# EAGLE schematic pipistrello_v2 (EAGLE 6.3)

## Sheet 1 of 5
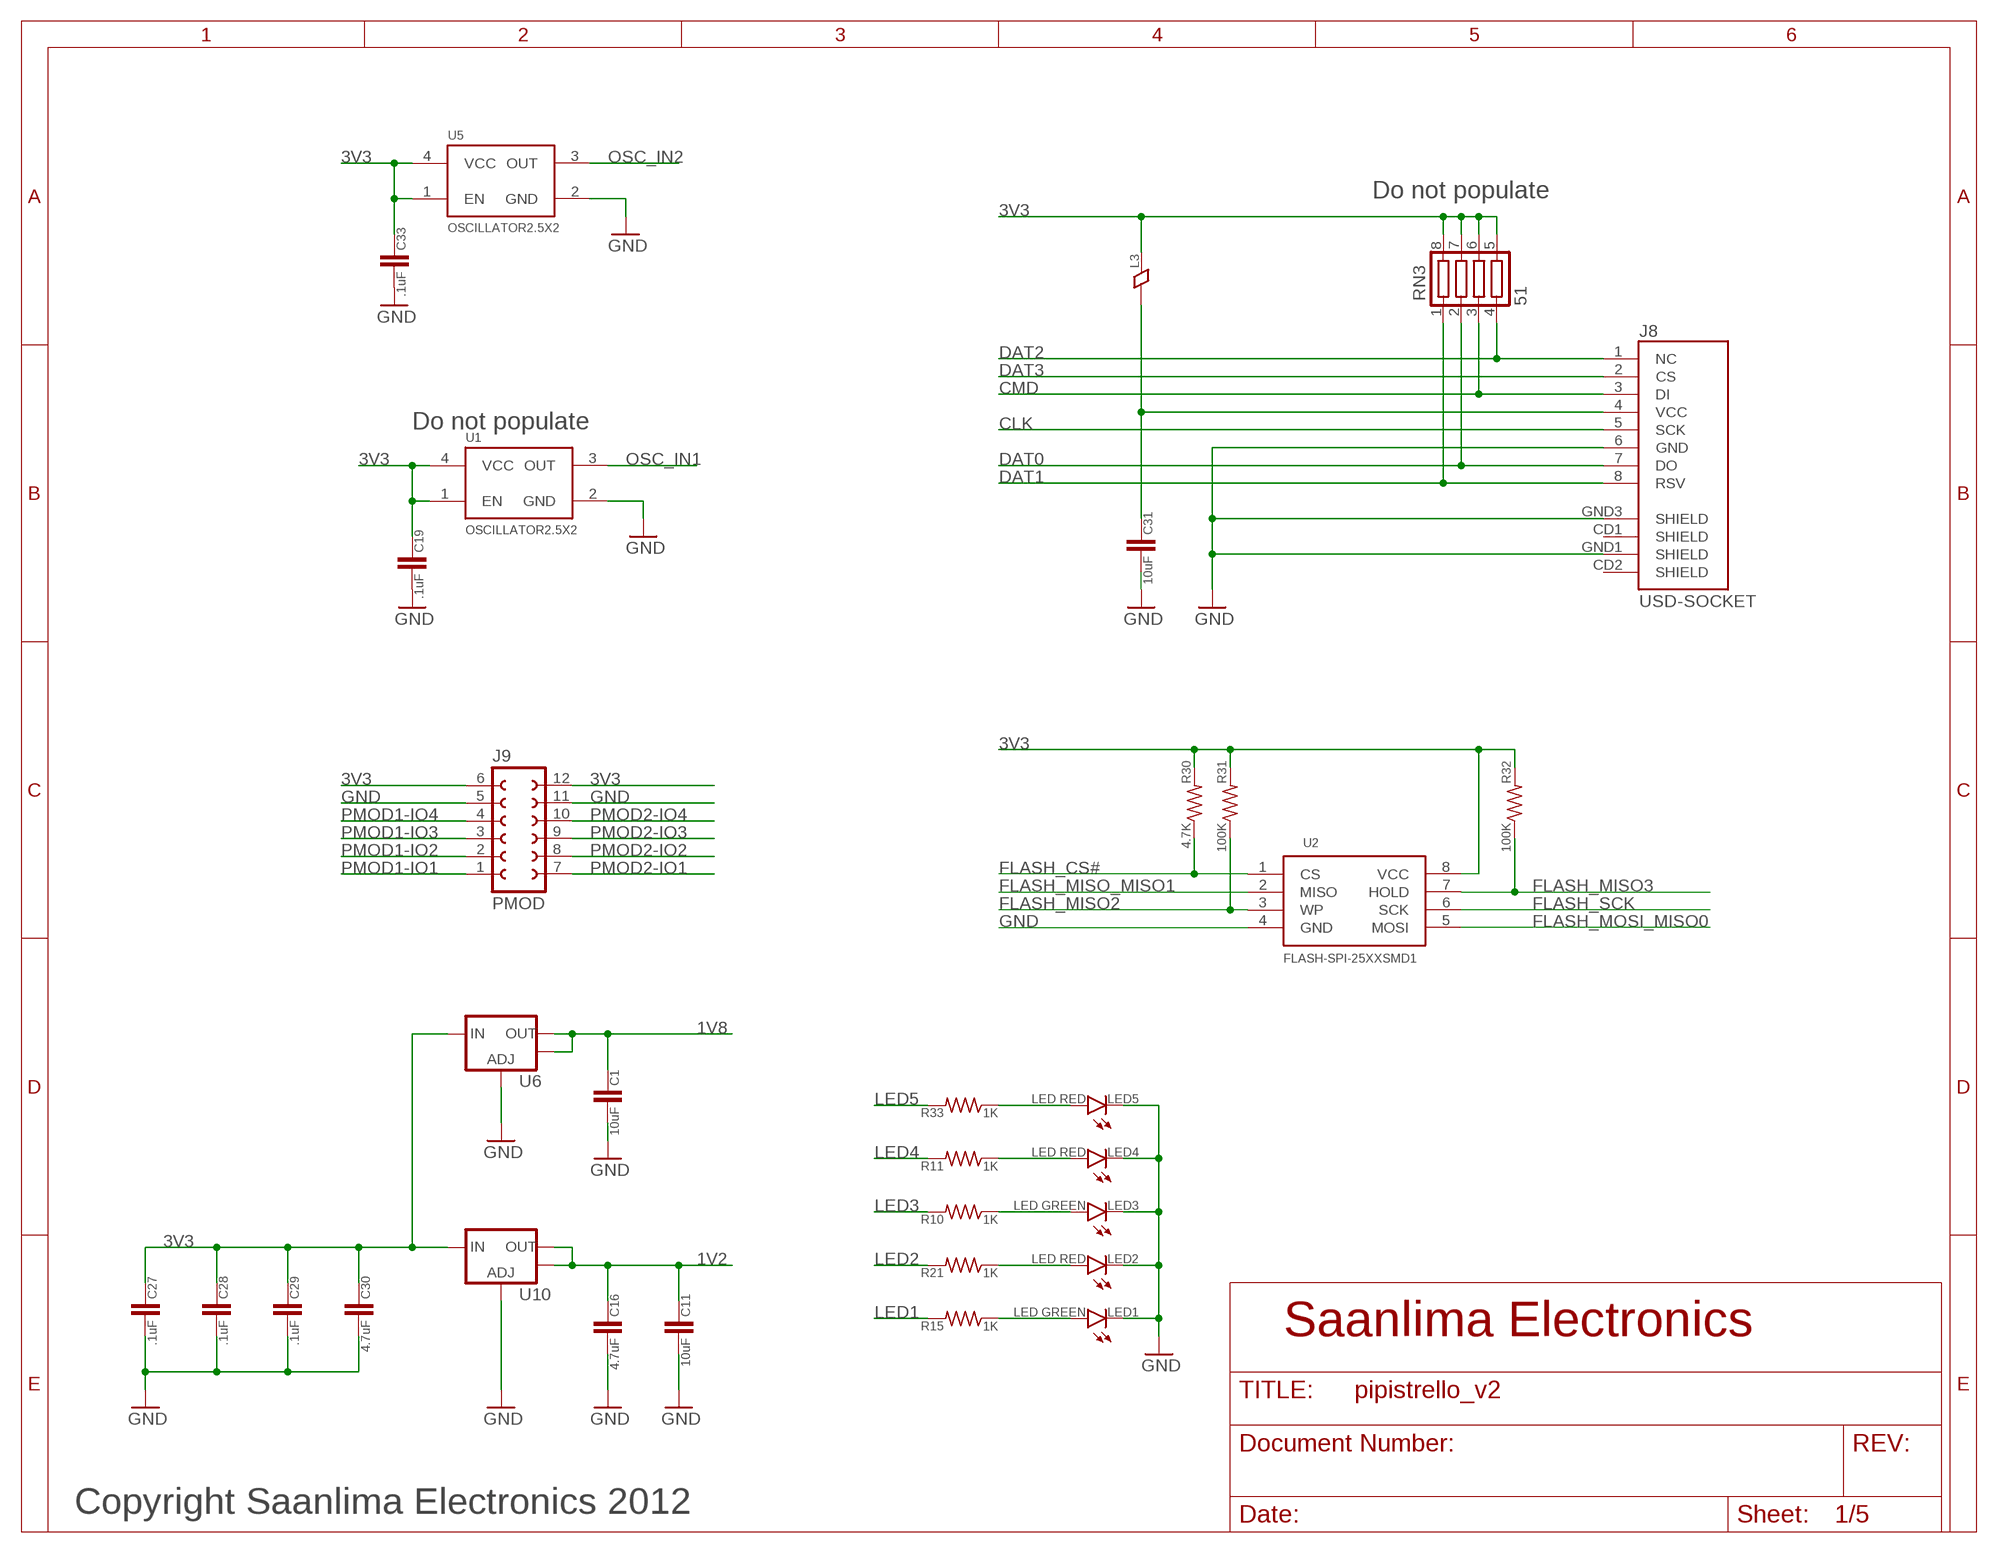
[diagram p0: schematic, sheet 1]

### Parts
C1  10uF  C0805  [0805]
C11  10uF  C0805  [0805]
C16  4.7uF  C0402  [0402]
C19  .1uF  C0402  [0402]
C27  .1uF  C0402  [0402]
C28  .1uF  C0402  [0402]
C29  .1uF  C0402  [0402]
C30  4.7uF  C0402  [0402]
C31  10uF  C0603  [0603]
C33  .1uF  C0402  [0402]
J8  USD-SOCKET  USD-SOCKETNEW  [MICRO-SD-SOCKET-PP]
J9  PMOD  [PMOD]
L3  FERRITE0402  [0402]
LED1  LED GREEN  LED0805  [0805_POL]
LED2  LED RED  LED0805  [0805_POL]
LED3  LED GREEN  LED0805  [0805_POL]
LED4  LED RED  LED0805  [0805_POL]
LED5  LED RED  LED0805  [0805_POL]
R10  1K  R0402  [0402]
R11  1K  R0402  [0402]
R15  1K  R0402  [0402]
R21  1K  R0402  [0402]
R30  4.7K  R0402  [0402]
R31  100K  R0402  [0402]
R32  100K  R0402  [0402]
R33  1K  R0402  [0402]
RN3  51  CTS742C083  [CTS742C083]
U1  OSCILLATOR2.5X2  [CRYSTAL-OSC-SMD-2.5X2]
U2  FLASH-SPI-25XXSMD1  [SO08-EIAJ]
U5  OSCILLATOR2.5X2  [CRYSTAL-OSC-SMD-2.5X2]
U6  V_REG_LM1117SOT223  [SOT223]
U10  V_REG_LM1117SOT223  [SOT223]

### Nets
1V2: C11.1 C16.1 U10.2(OUT) U10.4(OUT) ; also sheet 3
1V8: C1.1 U6.2(OUT) U6.4(OUT) ; also sheet 3
3V3: C19.1 C27.1 C28.1 C29.1 C30.1 C33.1 J9.6 J9.12 L3.2 R30.2 R31.2 R32.2 RN3.5 RN3.6 RN3.7 RN3.8 U1.1(EN) U1.4(VCC) U2.8(VCC) U5.1(EN) U5.4(VCC) U6.3(IN) U10.3(IN) ; also sheet 2,3,4,5
CLK: J8.5(SCK) ; also sheet 3
CMD: J8.3(DI) RN3.3 ; also sheet 3
DAT0: J8.7(DO) RN3.2 ; also sheet 3
DAT1: J8.8(RSV) RN3.1 ; also sheet 3
DAT2: J8.1(NC) RN3.4 ; also sheet 3
DAT3: J8.2(CS) ; also sheet 3
FLASH_CS#: R30.1 U2.1(CS) ; also sheet 3
FLASH_MISO2: R31.1 U2.3(WP) ; also sheet 3
FLASH_MISO3: R32.1 U2.7(HOLD) ; also sheet 3
FLASH_MISO_MISO1: U2.2(MISO) ; also sheet 3
FLASH_MOSI_MISO0: U2.5(MOSI) ; also sheet 3
FLASH_SCK: U2.6(SCK) ; also sheet 3
GND: C1.2 C11.2 C16.2 C19.2 C27.2 C28.2 C29.2 C30.2 C31.2 C33.2 J8.6(GND) J8.GND1(SHIELD) J8.GND3(SHIELD) J9.5 J9.11 LED1.-(C) LED2.-(C) LED3.-(C) LED4.-(C) LED5.-(C) U1.2(GND) U2.4(GND) U5.2(GND) U6.1(ADJ) U10.1(ADJ) ; also sheet 2,3,4,5
LED1: R15.2 ; also sheet 3
LED2: R21.2 ; also sheet 3
LED3: R10.2 ; also sheet 3
LED4: R11.2 ; also sheet 3
LED5: R33.2 ; also sheet 3
N$3: LED2.+(A) R21.1
N$6: LED3.+(A) R10.1
N$7: C31.1 J8.4(VCC) L3.1
N$8: LED1.+(A) R15.1
N$12: LED4.+(A) R11.1
N$24: LED5.+(A) R33.1
OSC_IN1: U1.3(OUT) ; also sheet 3
OSC_IN2: U5.3(OUT) ; also sheet 3
PMOD1-IO1: J9.1 ; also sheet 3
PMOD1-IO2: J9.2 ; also sheet 3
PMOD1-IO3: J9.3 ; also sheet 3
PMOD1-IO4: J9.4 ; also sheet 3
PMOD2-IO1: J9.7 ; also sheet 3
PMOD2-IO2: J9.8 ; also sheet 3
PMOD2-IO3: J9.9 ; also sheet 3
PMOD2-IO4: J9.10 ; also sheet 3
Unconnected: J8.CD1(SHIELD) J8.CD2(SHIELD)

### Notes on the sheet
- Do not populate
- Do not populate
- Saanlima Electronics
- Copyright Saanlima Electronics 2012

## Sheet 2 of 5
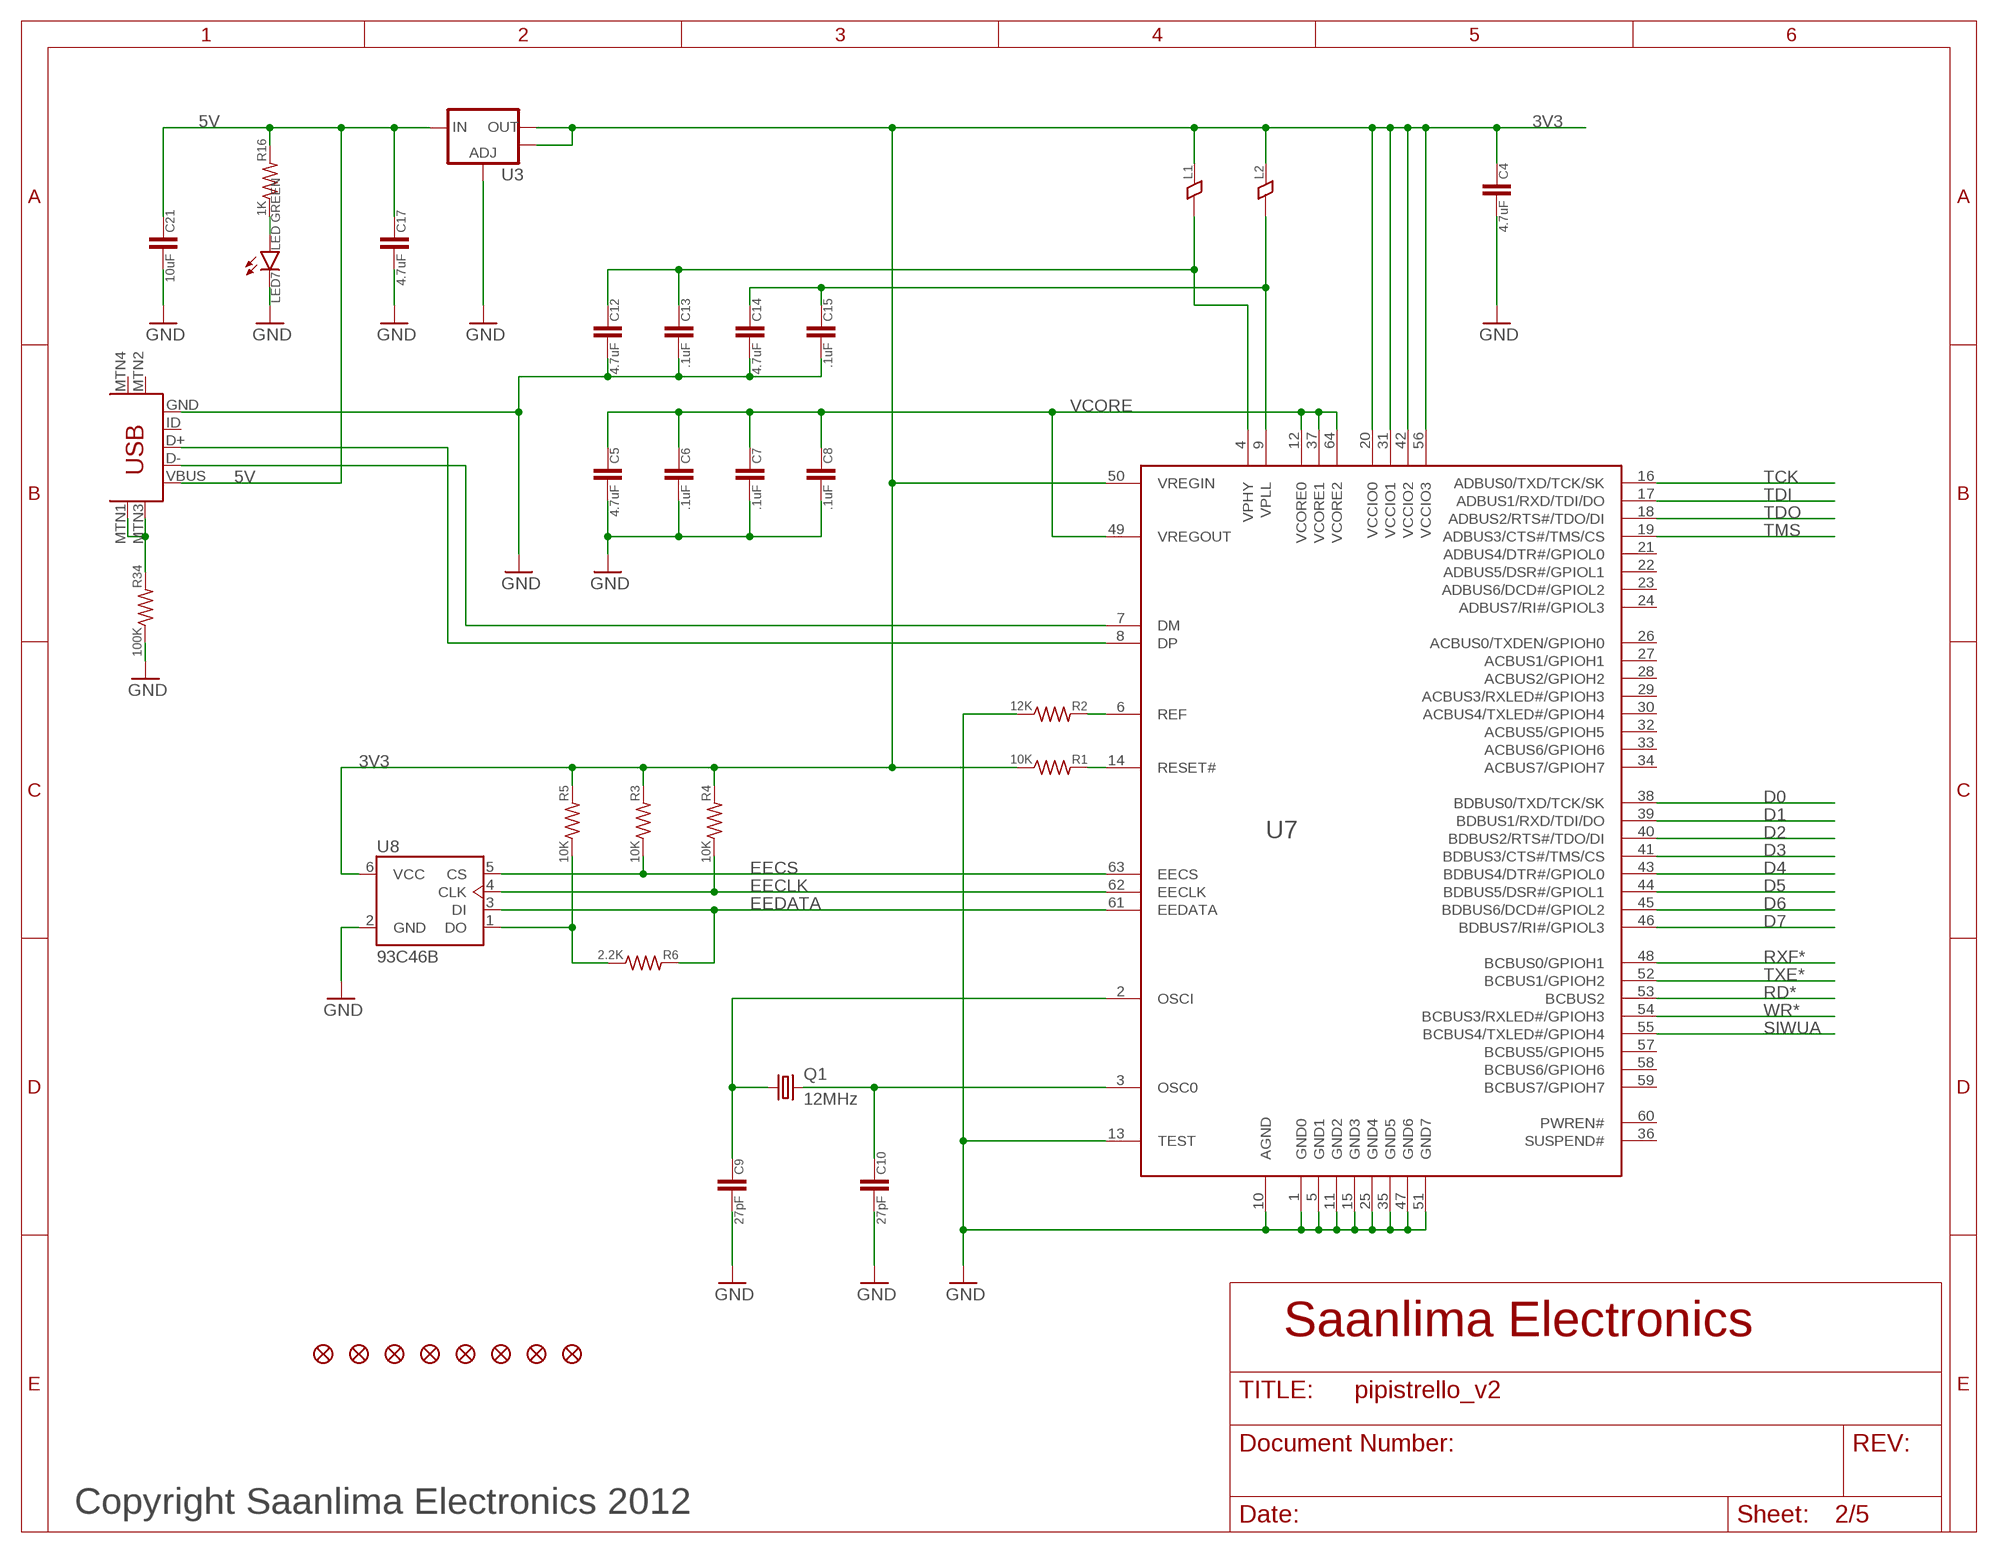
[diagram p1: schematic, sheet 2]

### Parts
C4  4.7uF  C0402  [0402]
C5  4.7uF  C0402  [0402]
C6  .1uF  C0402  [0402]
C7  .1uF  C0402  [0402]
C8  .1uF  C0402  [0402]
C9  27pF  C0402  [0402]
C10  27pF  C0402  [0402]
C12  4.7uF  C0402  [0402]
C13  .1uF  C0402  [0402]
C14  4.7uF  C0402  [0402]
C15  .1uF  C0402  [0402]
C17  4.7uF  C0402  [0402]
C21  10uF  C0603  [0603]
J7  USB-MINIB-5PIN  [USB-MINIB]
JP1  FIDUCIAL1X2  [FIDUCIAL-1X2]
JP2  FIDUCIAL1X2  [FIDUCIAL-1X2]
JP3  FIDUCIAL1X2  [FIDUCIAL-1X2]
JP4  FIDUCIAL1X2  [FIDUCIAL-1X2]
JP5  FIDUCIAL1X2  [FIDUCIAL-1X2]
JP6  FIDUCIAL1X2  [FIDUCIAL-1X2]
JP7  FIDUCIAL1X2  [FIDUCIAL-1X2]
JP8  FIDUCIAL1X2  [FIDUCIAL-1X2]
L1  FERRITE0402  [0402]
L2  FERRITE0402  [0402]
LED7  LED GREEN  LED0805  [0805_POL]
Q1  12MHz  CRYSTAL3.2X2.5  [CRYSTAL3.2X2.5MM]
R1  10K  R0402  [0402]
R2  12K  R0402  [0402]
R3  10K  R0402  [0402]
R4  10K  R0402  [0402]
R5  10K  R0402  [0402]
R6  2.2K  R0402  [0402]
R16  1K  R0402  [0402]
R34  100K  R0402  [0402]
U3  V_REG_LM1117SOT223  [SOT223]
U7  FT2232H  [LQFP64]
U8  93C46B  DIGITAL-EEPROM-MICROWIRE-6P_SOT23  [SOT23-6]

### Nets
3V3: C4.1 L1.2 L2.2 R1.1 R3.2 R4.2 R5.2 U3.2(OUT) U3.4(OUT) U7.20(VCCIO0) U7.31(VCCIO1) U7.42(VCCIO2) U7.50(VREGIN) U7.56(VCCIO3) U8.6(VCC) ; also sheet 1,3,4,5
5V [power]: C17.1 C21.1 J7.VBUS R16.2 U3.3(IN) ; also sheet 4,5
D0: U7.38(BDBUS0/TXD/TCK/SK) ; also sheet 3
D1: U7.39(BDBUS1/RXD/TDI/DO) ; also sheet 3
D2: U7.40(BDBUS2/RTS#/TDO/DI) ; also sheet 3
D3: U7.41(BDBUS3/CTS#/TMS/CS) ; also sheet 3
D4: U7.43(BDBUS4/DTR#/GPIOL0) ; also sheet 3
D5: U7.44(BDBUS5/DSR#/GPIOL1) ; also sheet 3
D6: U7.45(BDBUS6/DCD#/GPIOL2) ; also sheet 3
D7: U7.46(BDBUS7/RI#/GPIOL3) ; also sheet 3
EECLK: R4.1 U7.62(EECLK) U8.4(CLK)
EECS: R3.1 U7.63(EECS) U8.5(CS)
EEDATA: R6.2 U7.61(EEDATA) U8.3(DI)
GND: C4.2 C5.2 C6.2 C7.2 C8.2 C9.2 C10.2 C12.2 C13.2 C14.2 C15.2 C17.2 C21.2 J7.GND LED7.-(C) R2.1 R34.1 U3.1(ADJ) U7.1(GND0) U7.5(GND1) U7.10(AGND) U7.11(GND2) U7.13(TEST) U7.15(GND3) U7.25(GND4) U7.35(GND5) U7.47(GND6) U7.51(GND7) U8.2(GND) ; also sheet 1,3,4,5
N$4: J7.MTN1(MTN2) J7.MTN3(MTN1) R34.2
N$9: C9.1 Q1.1 U7.2(OSCI)
N$10: C10.1 Q1.3 U7.3(OSC0)
N$11: LED7.+(A) R16.1
N$13: J7.D- U7.7(DM)
N$14: J7.D+ U7.8(DP)
N$18: C14.1 C15.1 L2.1 U7.9(VPLL)
N$19: R1.2 U7.14(RESET#)
N$20: R2.2 U7.6(REF)
N$21: C12.1 C13.1 L1.1 U7.4(VPHY)
N$27: R5.1 R6.1 U8.1(DO)
RD*: U7.53(BCBUS2) ; also sheet 3
RXF*: U7.48(BCBUS0/GPIOH1) ; also sheet 3
SIWUA: U7.55(BCBUS4/TXLED#/GPIOH4) ; also sheet 3
TCK: U7.16(ADBUS0/TXD/TCK/SK) ; also sheet 3
TDI: U7.17(ADBUS1/RXD/TDI/DO) ; also sheet 3
TDO: U7.18(ADBUS2/RTS#/TDO/DI) ; also sheet 3
TMS: U7.19(ADBUS3/CTS#/TMS/CS) ; also sheet 3
TXE*: U7.52(BCBUS1/GPIOH2) ; also sheet 3
VCORE: C5.1 C6.1 C7.1 C8.1 U7.12(VCORE0) U7.37(VCORE1) U7.49(VREGOUT) U7.64(VCORE2)
WR*: U7.54(BCBUS3/RXLED#/GPIOH3) ; also sheet 3
Unconnected: J7.ID J7.MTN2(MTN3) J7.MTN4 U7.21(ADBUS4/DTR#/GPIOL0) U7.22(ADBUS5/DSR#/GPIOL1) U7.23(ADBUS6/DCD#/GPIOL2) U7.24(ADBUS7/RI#/GPIOL3) U7.26(ACBUS0/TXDEN/GPIOH0) U7.27(ACBUS1/GPIOH1) U7.28(ACBUS2/GPIOH2) U7.29(ACBUS3/RXLED#/GPIOH3) U7.30(ACBUS4/TXLED#/GPIOH4) U7.32(ACBUS5/GPIOH5) U7.33(ACBUS6/GPIOH6) U7.34(ACBUS7/GPIOH7) U7.36(SUSPEND#) U7.57(BCBUS5/GPIOH5) U7.58(BCBUS6/GPIOH6) U7.59(BCBUS7/GPIOH7) U7.60(PWREN#)

### Notes on the sheet
- Saanlima Electronics
- Copyright Saanlima Electronics 2012

## Sheet 3 of 5
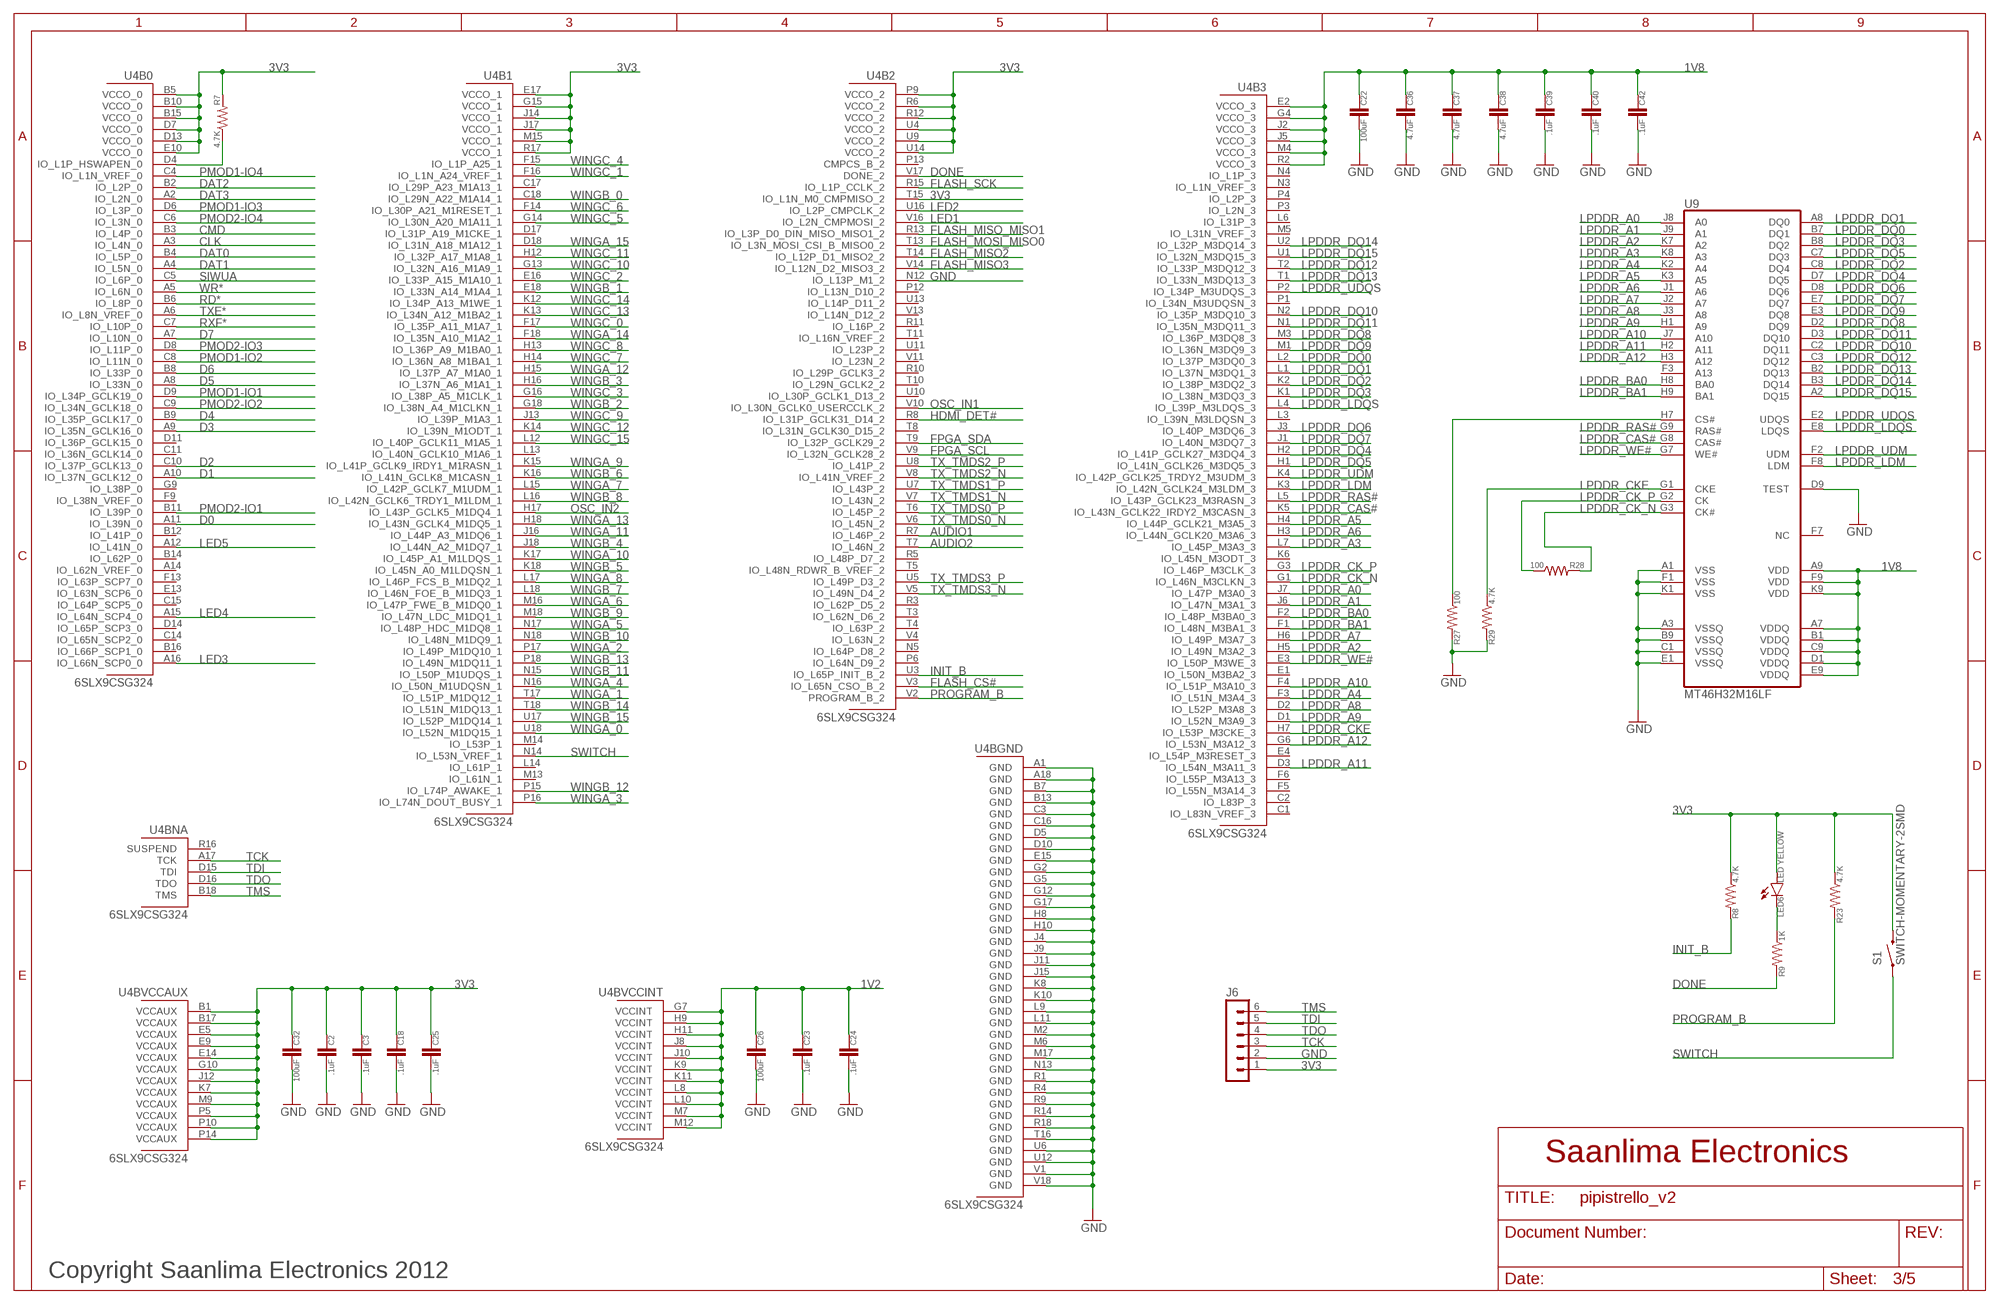
[diagram p2: schematic, sheet 3]

### Parts
C2  .1uF  C0402  [0402]
C3  .1uF  C0402  [0402]
C18  .1uF  C0402  [0402]
C22  100uF  C1206  [1206]
C23  .1uF  C0402  [0402]
C24  .1uF  C0402  [0402]
C25  .1uF  C0402  [0402]
C26  100uF  C1206  [1206]
C32  100uF  C1206  [1206]
C36  4.7uF  C0402  [0402]
C37  4.7uF  C0402  [0402]
C38  4.7uF  C0402  [0402]
C39  .1uF  C0402  [0402]
C40  .1uF  C0402  [0402]
C42  .1uF  C0402  [0402]
J6  MA06-1  [MA06-1]
LED6  LED YELLOW  LED0805  [0805_POL]
R7  4.7K  R0402  [0402]
R8  4.7K  R0402  [0402]
R9  1K  R0402  [0402]
R23  4.7K  R0402  [0402]
R27  100  R0402  [0402]
R28  100  R0402  [0402]
R29  4.7K  R0402  [0402]
S1  SWITCH-MOMENTARY-2SMD  [TACTILE_SWITCH_SMD]
U4  6SLX9CSG324  [CS324]
U9  MT46H32M16LF  [FBFA60-6X10]

### Nets
1V2: C23.1 C24.1 C26.1 U4.G7(BVCCINT:VCCINT) U4.H9(BVCCINT:VCCINT) U4.H11(BVCCINT:VCCINT) U4.J8(BVCCINT:VCCINT) U4.J10(BVCCINT:VCCINT) U4.K9(BVCCINT:VCCINT) U4.K11(BVCCINT:VCCINT) U4.L8(BVCCINT:VCCINT) U4.L10(BVCCINT:VCCINT) U4.M7(BVCCINT:VCCINT) U4.M12(BVCCINT:VCCINT) ; also sheet 1
1V8: C22.1 C36.1 C37.1 C38.1 C39.1 C40.1 C42.1 U4.E2(B3:VCCO_3) U4.G4(B3:VCCO_3) U4.J2(B3:VCCO_3) U4.J5(B3:VCCO_3) U4.M4(B3:VCCO_3) U4.R2(B3:VCCO_3) U9.A7(VDDQ) U9.A9(VDD) U9.B1(VDDQ) U9.C9(VDDQ) U9.D1(VDDQ) U9.E9(VDDQ) U9.F9(VDD) U9.K9(VDD) ; also sheet 1
3V3: C2.1 C3.1 C18.1 C25.1 C32.1 J6.1 LED6.+(A) R7.2 R8.1 R23.1 S1.3 U4.B1(BVCCAUX:VCCAUX) U4.B5(B0:VCCO_0) U4.B10(B0:VCCO_0) U4.B15(B0:VCCO_0) U4.B17(BVCCAUX:VCCAUX) U4.D7(B0:VCCO_0) U4.D13(B0:VCCO_0) U4.E5(BVCCAUX:VCCAUX) U4.E9(BVCCAUX:VCCAUX) U4.E10(B0:VCCO_0) U4.E14(BVCCAUX:VCCAUX) U4.E17(B1:VCCO_1) U4.G10(BVCCAUX:VCCAUX) U4.G15(B1:VCCO_1) U4.J12(BVCCAUX:VCCAUX) U4.J14(B1:VCCO_1) U4.J17(B1:VCCO_1) U4.K7(BVCCAUX:VCCAUX) U4.M9(BVCCAUX:VCCAUX) U4.M15(B1:VCCO_1) U4.P5(BVCCAUX:VCCAUX) U4.P9(B2:VCCO_2) U4.P10(BVCCAUX:VCCAUX) U4.P14(BVCCAUX:VCCAUX) U4.R6(B2:VCCO_2) U4.R12(B2:VCCO_2) U4.R17(B1:VCCO_1) U4.T15(B2:IO_L1N_M0_CMPMISO_2) U4.U4(B2:VCCO_2) U4.U9(B2:VCCO_2) U4.U14(B2:VCCO_2) ; also sheet 1,2,4,5
AUDIO1: U4.R7(B2:IO_L46P_2) ; also sheet 4
AUDIO2: U4.T7(B2:IO_L46N_2) ; also sheet 4
CLK: U4.A3(B0:IO_L4N_0) ; also sheet 1
CMD: U4.B3(B0:IO_L4P_0) ; also sheet 1
D0: U4.A11(B0:IO_L39N_0) ; also sheet 2
D1: U4.A10(B0:IO_L37N_GCLK12_0) ; also sheet 2
D2: U4.C10(B0:IO_L37P_GCLK13_0) ; also sheet 2
D3: U4.A9(B0:IO_L35N_GCLK16_0) ; also sheet 2
D4: U4.B9(B0:IO_L35P_GCLK17_0) ; also sheet 2
D5: U4.A8(B0:IO_L33N_0) ; also sheet 2
D6: U4.B8(B0:IO_L33P_0) ; also sheet 2
D7: U4.A7(B0:IO_L10N_0) ; also sheet 2
DAT0: U4.B4(B0:IO_L5P_0) ; also sheet 1
DAT1: U4.A4(B0:IO_L5N_0) ; also sheet 1
DAT2: U4.B2(B0:IO_L2P_0) ; also sheet 1
DAT3: U4.A2(B0:IO_L2N_0) ; also sheet 1
DONE: R9.2 U4.V17(B2:DONE_2)
FLASH_CS#: U4.V3(B2:IO_L65N_CSO_B_2) ; also sheet 1
FLASH_MISO2: U4.T14(B2:IO_L12P_D1_MISO2_2) ; also sheet 1
FLASH_MISO3: U4.V14(B2:IO_L12N_D2_MISO3_2) ; also sheet 1
FLASH_MISO_MISO1: U4.R13(B2:IO_L3P_D0_DIN_MISO_MISO1_2) ; also sheet 1
FLASH_MOSI_MISO0: U4.T13(B2:IO_L3N_MOSI_CSI_B_MISO0_2) ; also sheet 1
FLASH_SCK: U4.R15(B2:IO_L1P_CCLK_2) ; also sheet 1
FPGA_SCL: U4.V9(B2:IO_L32N_GCLK28_2) ; also sheet 4
FPGA_SDA: U4.T9(B2:IO_L32P_GCLK29_2) ; also sheet 4
GND: C2.2 C3.2 C18.2 C22.2 C23.2 C24.2 C25.2 C26.2 C32.2 C36.2 C37.2 C38.2 C39.2 C40.2 C42.2 J6.2 R27.2 R29.2 U4.A1(BGND:GND) U4.A18(BGND:GND) U4.B7(BGND:GND) U4.B13(BGND:GND) U4.C3(BGND:GND) U4.C16(BGND:GND) U4.D5(BGND:GND) U4.D10(BGND:GND) U4.E15(BGND:GND) U4.G2(BGND:GND) U4.G5(BGND:GND) U4.G12(BGND:GND) U4.G17(BGND:GND) U4.H8(BGND:GND) U4.H10(BGND:GND) U4.J4(BGND:GND) U4.J9(BGND:GND) U4.J11(BGND:GND) U4.J15(BGND:GND) U4.K8(BGND:GND) U4.K10(BGND:GND) U4.L9(BGND:GND) U4.L11(BGND:GND) U4.M2(BGND:GND) U4.M6(BGND:GND) U4.M17(BGND:GND) U4.N12(B2:IO_L13P_M1_2) U4.N13(BGND:GND) U4.R1(BGND:GND) U4.R4(BGND:GND) U4.R9(BGND:GND) U4.R14(BGND:GND) U4.R18(BGND:GND) U4.T16(BGND:GND) U4.U6(BGND:GND) U4.U12(BGND:GND) U4.V1(BGND:GND) U4.V18(BGND:GND) U9.A1(VSS) U9.A3(VSSQ) U9.B9(VSSQ) U9.C1(VSSQ) U9.D9(TEST) U9.E1(VSSQ) U9.F1(VSS) U9.K1(VSS) ; also sheet 1,2,4,5
HDMI_DET#: U4.R8(B2:IO_L31P_GCLK31_D14_2) ; also sheet 4
INIT_B: R8.2 U4.U3(B2:IO_L65P_INIT_B_2)
LED1: U4.V16(B2:IO_L2N_CMPMOSI_2) ; also sheet 1
LED2: U4.U16(B2:IO_L2P_CMPCLK_2) ; also sheet 1
LED3: U4.A16(B0:IO_L66N_SCP0_0) ; also sheet 1
LED4: U4.A15(B0:IO_L64N_SCP4_0) ; also sheet 1
LED5: U4.A12(B0:IO_L41N_0) ; also sheet 1
LPDDR_A0: U4.J7(B3:IO_L47P_M3A0_3) U9.J8(A0)
LPDDR_A1: U4.J6(B3:IO_L47N_M3A1_3) U9.J9(A1)
LPDDR_A2: U4.H5(B3:IO_L49N_M3A2_3) U9.K7(A2)
LPDDR_A3: U4.L7(B3:IO_L45P_M3A3_3) U9.K8(A3)
LPDDR_A4: U4.F3(B3:IO_L51N_M3A4_3) U9.K2(A4)
LPDDR_A5: U4.H4(B3:IO_L44P_GCLK21_M3A5_3) U9.K3(A5)
LPDDR_A6: U4.H3(B3:IO_L44N_GCLK20_M3A6_3) U9.J1(A6)
LPDDR_A7: U4.H6(B3:IO_L49P_M3A7_3) U9.J2(A7)
LPDDR_A8: U4.D2(B3:IO_L52P_M3A8_3) U9.J3(A8)
LPDDR_A9: U4.D1(B3:IO_L52N_M3A9_3) U9.H1(A9)
LPDDR_A10: U4.F4(B3:IO_L51P_M3A10_3) U9.J7(A10)
LPDDR_A11: U4.D3(B3:IO_L54N_M3A11_3) U9.H2(A11)
LPDDR_A12: U4.G6(B3:IO_L53N_M3A12_3) U9.H3(A12)
LPDDR_BA0: U4.F2(B3:IO_L48P_M3BA0_3) U9.H8(BA0)
LPDDR_BA1: U4.F1(B3:IO_L48N_M3BA1_3) U9.H9(BA1)
LPDDR_CAS#: U4.K5(B3:IO_L43N_GCLK22_IRDY2_M3CASN_3) U9.G8(CAS#)
LPDDR_CK_N: R28.2 U4.G1(B3:IO_L46N_M3CLKN_3) U9.G3(CK#)
LPDDR_CK_P: R28.1 U4.G3(B3:IO_L46P_M3CLK_3) U9.G2(CK)
LPDDR_CKE: R29.1 U4.H7(B3:IO_L53P_M3CKE_3) U9.G1(CKE)
LPDDR_CS#: R27.1 U9.H7(CS#)
LPDDR_DQ0: U4.L2(B3:IO_L37P_M3DQ0_3) U9.B7(DQ1)
LPDDR_DQ1: U4.L1(B3:IO_L37N_M3DQ1_3) U9.A8(DQ0)
LPDDR_DQ2: U4.K2(B3:IO_L38P_M3DQ2_3) U9.C8(DQ4)
LPDDR_DQ3: U4.K1(B3:IO_L38N_M3DQ3_3) U9.B8(DQ2)
LPDDR_DQ4: U4.H2(B3:IO_L41P_GCLK27_M3DQ4_3) U9.D7(DQ5)
LPDDR_DQ5: U4.H1(B3:IO_L41N_GCLK26_M3DQ5_3) U9.C7(DQ3)
LPDDR_DQ6: U4.J3(B3:IO_L40P_M3DQ6_3) U9.D8(DQ6)
LPDDR_DQ7: U4.J1(B3:IO_L40N_M3DQ7_3) U9.E7(DQ7)
LPDDR_DQ8: U4.M3(B3:IO_L36P_M3DQ8_3) U9.D2(DQ9)
LPDDR_DQ9: U4.M1(B3:IO_L36N_M3DQ9_3) U9.E3(DQ8)
LPDDR_DQ10: U4.N2(B3:IO_L35P_M3DQ10_3) U9.C2(DQ11)
LPDDR_DQ11: U4.N1(B3:IO_L35N_M3DQ11_3) U9.D3(DQ10)
LPDDR_DQ12: U4.T2(B3:IO_L33P_M3DQ12_3) U9.C3(DQ12)
LPDDR_DQ13: U4.T1(B3:IO_L33N_M3DQ13_3) U9.B2(DQ13)
LPDDR_DQ14: U4.U2(B3:IO_L32P_M3DQ14_3) U9.B3(DQ14)
LPDDR_DQ15: U4.U1(B3:IO_L32N_M3DQ15_3) U9.A2(DQ15)
LPDDR_LDM: U4.K3(B3:IO_L42N_GCLK24_M3LDM_3) U9.F8(LDM)
LPDDR_LDQS: U4.L4(B3:IO_L39P_M3LDQS_3) U9.E8(LDQS)
LPDDR_RAS#: U4.L5(B3:IO_L43P_GCLK23_M3RASN_3) U9.G9(RAS#)
LPDDR_UDM: U4.K4(B3:IO_L42P_GCLK25_TRDY2_M3UDM_3) U9.F2(UDM)
LPDDR_UDQS: U4.P2(B3:IO_L34P_M3UDQS_3) U9.E2(UDQS)
LPDDR_WE#: U4.E3(B3:IO_L50P_M3WE_3) U9.G7(WE#)
N$1: R7.1 U4.D4(B0:IO_L1P_HSWAPEN_0)
N$5: LED6.-(C) R9.1
OSC_IN1: U4.V10(B2:IO_L30N_GCLK0_USERCCLK_2) ; also sheet 1
OSC_IN2: U4.H17(B1:IO_L43P_GCLK5_M1DQ4_1) ; also sheet 1
PMOD1-IO1: U4.D9(B0:IO_L34P_GCLK19_0) ; also sheet 1
PMOD1-IO2: U4.C8(B0:IO_L11N_0) ; also sheet 1
PMOD1-IO3: U4.D6(B0:IO_L3P_0) ; also sheet 1
PMOD1-IO4: U4.C4(B0:IO_L1N_VREF_0) ; also sheet 1
PMOD2-IO1: U4.B11(B0:IO_L39P_0) ; also sheet 1
PMOD2-IO2: U4.C9(B0:IO_L34N_GCLK18_0) ; also sheet 1
PMOD2-IO3: U4.D8(B0:IO_L11P_0) ; also sheet 1
PMOD2-IO4: U4.C6(B0:IO_L3N_0) ; also sheet 1
PROGRAM_B: R23.2 U4.V2(B2:PROGRAM_B_2)
RD*: U4.B6(B0:IO_L8P_0) ; also sheet 2
RXF*: U4.C7(B0:IO_L10P_0) ; also sheet 2
SIWUA: U4.C5(B0:IO_L6P_0) ; also sheet 2
SWITCH: S1.1 U4.N14(B1:IO_L53N_VREF_1)
TCK: J6.3 U4.A17(BNA:TCK) ; also sheet 2
TDI: J6.5 U4.D15(BNA:TDI) ; also sheet 2
TDO: J6.4 U4.D16(BNA:TDO) ; also sheet 2
TMS: J6.6 U4.B18(BNA:TMS) ; also sheet 2
TX_TMDS0_N: U4.V6(B2:IO_L45N_2) ; also sheet 4
TX_TMDS0_P: U4.T6(B2:IO_L45P_2) ; also sheet 4
TX_TMDS1_N: U4.V7(B2:IO_L43N_2) ; also sheet 4
TX_TMDS1_P: U4.U7(B2:IO_L43P_2) ; also sheet 4
TX_TMDS2_N: U4.V8(B2:IO_L41N_VREF_2) ; also sheet 4
TX_TMDS2_P: U4.U8(B2:IO_L41P_2) ; also sheet 4
TX_TMDS3_N: U4.V5(B2:IO_L49N_D4_2) ; also sheet 4
TX_TMDS3_P: U4.U5(B2:IO_L49P_D3_2) ; also sheet 4
TXE*: U4.A6(B0:IO_L8N_VREF_0) ; also sheet 2
WINGA_0: U4.U18(B1:IO_L52N_M1DQ15_1) ; also sheet 5
WINGA_1: U4.T17(B1:IO_L51P_M1DQ12_1) ; also sheet 5
WINGA_2: U4.P17(B1:IO_L49P_M1DQ10_1) ; also sheet 5
WINGA_3: U4.P16(B1:IO_L74N_DOUT_BUSY_1) ; also sheet 5
WINGA_4: U4.N16(B1:IO_L50N_M1UDQSN_1) ; also sheet 5
WINGA_5: U4.N17(B1:IO_L48P_HDC_M1DQ8_1) ; also sheet 5
WINGA_6: U4.M16(B1:IO_L47P_FWE_B_M1DQ0_1) ; also sheet 5
WINGA_7: U4.L15(B1:IO_L42P_GCLK7_M1UDM_1) ; also sheet 5
WINGA_8: U4.L17(B1:IO_L46P_FCS_B_M1DQ2_1) ; also sheet 5
WINGA_9: U4.K15(B1:IO_L41P_GCLK9_IRDY1_M1RASN_1) ; also sheet 5
WINGA_10: U4.K17(B1:IO_L45P_A1_M1LDQS_1) ; also sheet 5
WINGA_11: U4.J16(B1:IO_L44P_A3_M1DQ6_1) ; also sheet 5
WINGA_12: U4.H15(B1:IO_L37P_A7_M1A0_1) ; also sheet 5
WINGA_13: U4.H18(B1:IO_L43N_GCLK4_M1DQ5_1) ; also sheet 5
WINGA_14: U4.F18(B1:IO_L35N_A10_M1A2_1) ; also sheet 5
WINGA_15: U4.D18(B1:IO_L31N_A18_M1A12_1) ; also sheet 5
WINGB_0: U4.C18(B1:IO_L29N_A22_M1A14_1) ; also sheet 5
WINGB_1: U4.E18(B1:IO_L33N_A14_M1A4_1) ; also sheet 5
WINGB_2: U4.G18(B1:IO_L38N_A4_M1CLKN_1) ; also sheet 5
WINGB_3: U4.H16(B1:IO_L37N_A6_M1A1_1) ; also sheet 5
WINGB_4: U4.J18(B1:IO_L44N_A2_M1DQ7_1) ; also sheet 5
WINGB_5: U4.K18(B1:IO_L45N_A0_M1LDQSN_1) ; also sheet 5
WINGB_6: U4.K16(B1:IO_L41N_GCLK8_M1CASN_1) ; also sheet 5
WINGB_7: U4.L18(B1:IO_L46N_FOE_B_M1DQ3_1) ; also sheet 5
WINGB_8: U4.L16(B1:IO_L42N_GCLK6_TRDY1_M1LDM_1) ; also sheet 5
WINGB_9: U4.M18(B1:IO_L47N_LDC_M1DQ1_1) ; also sheet 5
WINGB_10: U4.N18(B1:IO_L48N_M1DQ9_1) ; also sheet 5
WINGB_11: U4.N15(B1:IO_L50P_M1UDQS_1) ; also sheet 5
WINGB_12: U4.P15(B1:IO_L74P_AWAKE_1) ; also sheet 5
WINGB_13: U4.P18(B1:IO_L49N_M1DQ11_1) ; also sheet 5
WINGB_14: U4.T18(B1:IO_L51N_M1DQ13_1) ; also sheet 5
WINGB_15: U4.U17(B1:IO_L52P_M1DQ14_1) ; also sheet 5
WINGC_0: U4.F17(B1:IO_L35P_A11_M1A7_1) ; also sheet 5
WINGC_1: U4.F16(B1:IO_L1N_A24_VREF_1) ; also sheet 5
WINGC_2: U4.E16(B1:IO_L33P_A15_M1A10_1) ; also sheet 5
WINGC_3: U4.G16(B1:IO_L38P_A5_M1CLK_1) ; also sheet 5
WINGC_4: U4.F15(B1:IO_L1P_A25_1) ; also sheet 5
WINGC_5: U4.G14(B1:IO_L30N_A20_M1A11_1) ; also sheet 5
WINGC_6: U4.F14(B1:IO_L30P_A21_M1RESET_1) ; also sheet 5
WINGC_7: U4.H14(B1:IO_L36N_A8_M1BA1_1) ; also sheet 5
WINGC_8: U4.H13(B1:IO_L36P_A9_M1BA0_1) ; also sheet 5
WINGC_9: U4.J13(B1:IO_L39P_M1A3_1) ; also sheet 5
WINGC_10: U4.G13(B1:IO_L32N_A16_M1A9_1) ; also sheet 5
WINGC_11: U4.H12(B1:IO_L32P_A17_M1A8_1) ; also sheet 5
WINGC_12: U4.K14(B1:IO_L39N_M1ODT_1) ; also sheet 5
WINGC_13: U4.K13(B1:IO_L34N_A12_M1BA2_1) ; also sheet 5
WINGC_14: U4.K12(B1:IO_L34P_A13_M1WE_1) ; also sheet 5
WINGC_15: U4.L12(B1:IO_L40P_GCLK11_M1A5_1) ; also sheet 5
WR*: U4.A5(B0:IO_L6N_0) ; also sheet 2
Unconnected: U4.A13(BNOCONN:NC) U4.A14(B0:IO_L62N_VREF_0) U4.B12(B0:IO_L41P_0) U4.B14(B0:IO_L62P_0) U4.B16(B0:IO_L66P_SCP1_0) U4.C1(B3:IO_L83N_VREF_3) U4.C2(B3:IO_L83P_3) U4.C11(B0:IO_L36N_GCLK14_0) U4.C12(BNOCONN:NC) U4.C13(BNOCONN:NC) U4.C14(B0:IO_L65N_SCP2_0) U4.C15(B0:IO_L64P_SCP5_0) U4.C17(B1:IO_L29P_A23_M1A13_1) U4.D11(B0:IO_L36P_GCLK15_0) U4.D12(BNOCONN:NC) U4.D14(B0:IO_L65P_SCP3_0) U4.D17(B1:IO_L31P_A19_M1CKE_1) U4.E1(B3:IO_L50N_M3BA2_3) U4.E4(B3:IO_L54P_M3RESET_3) U4.E6(BNOCONN:NC) U4.E7(BNOCONN:NC) U4.E8(BNOCONN:NC) U4.E11(BNOCONN:NC) U4.E12(BNOCONN:NC) U4.E13(B0:IO_L63N_SCP6_0) U4.F5(B3:IO_L55N_M3A14_3) U4.F6(B3:IO_L55P_M3A13_3) U4.F7(BNOCONN:NC) U4.F8(BNOCONN:NC) U4.F9(B0:IO_L38N_VREF_0) U4.F10(BNOCONN:NC) U4.F11(BNOCONN:NC) U4.F12(BNOCONN:NC) U4.F13(B0:IO_L63P_SCP7_0) U4.G8(BNOCONN:NC) U4.G9(B0:IO_L38P_0) U4.G11(BNOCONN:NC) U4.K6(B3:IO_L45N_M3ODT_3) U4.L3(B3:IO_L39N_M3LDQSN_3) U4.L6(B3:IO_L31P_3) U4.L13(B1:IO_L40N_GCLK10_M1A6_1) U4.L14(B1:IO_L61P_1) U4.M5(B3:IO_L31N_VREF_3) U4.M8(BNOCONN:NC) U4.M10(BNOCONN:NC) U4.M11(BNOCONN:NC) U4.M13(B1:IO_L61N_1) U4.M14(B1:IO_L53P_1) U4.N3(B3:IO_L1N_VREF_3) U4.N4(B3:IO_L1P_3) U4.N5(B2:IO_L64P_D8_2) U4.N6(BNOCONN:NC) U4.N7(BNOCONN:NC) U4.N8(BNOCONN:NC) U4.N9(BNOCONN:NC) U4.N10(BNOCONN:NC) U4.N11(BNOCONN:NC) U4.P1(B3:IO_L34N_M3UDQSN_3) U4.P3(B3:IO_L2N_3) U4.P4(B3:IO_L2P_3) U4.P6(B2:IO_L64N_D9_2) U4.P7(BNOCONN:NC) U4.P8(BNOCONN:NC) U4.P11(BNOCONN:NC) U4.P12(B2:IO_L13N_D10_2) U4.P13(B2:CMPCS_B_2) U4.R3(B2:IO_L62P_D5_2) U4.R5(B2:IO_L48P_D7_2) U4.R10(B2:IO_L29P_GCLK3_2) U4.R11(B2:IO_L16P_2) U4.R16(BNA:SUSPEND) U4.T3(B2:IO_L62N_D6_2) U4.T4(B2:IO_L63P_2) U4.T5(B2:IO_L48N_RDWR_B_VREF_2) U4.T8(B2:IO_L31N_GCLK30_D15_2) U4.T10(B2:IO_L29N_GCLK2_2) U4.T11(B2:IO_L16N_VREF_2) U4.T12(BNOCONN:NC) U4.U10(B2:IO_L30P_GCLK1_D13_2) U4.U11(B2:IO_L23P_2) U4.U13(B2:IO_L14P_D11_2) U4.U15(BNOCONN:NC) U4.V4(B2:IO_L63N_2) U4.V11(B2:IO_L23N_2) U4.V12(BNOCONN:NC) U4.V13(B2:IO_L14N_D12_2) U4.V15(BNOCONN:NC) U9.F3(A13) U9.F7(NC)

### Notes on the sheet
- Saanlima Electronics
- Copyright Saanlima Electronics 2012

## Sheet 4 of 5
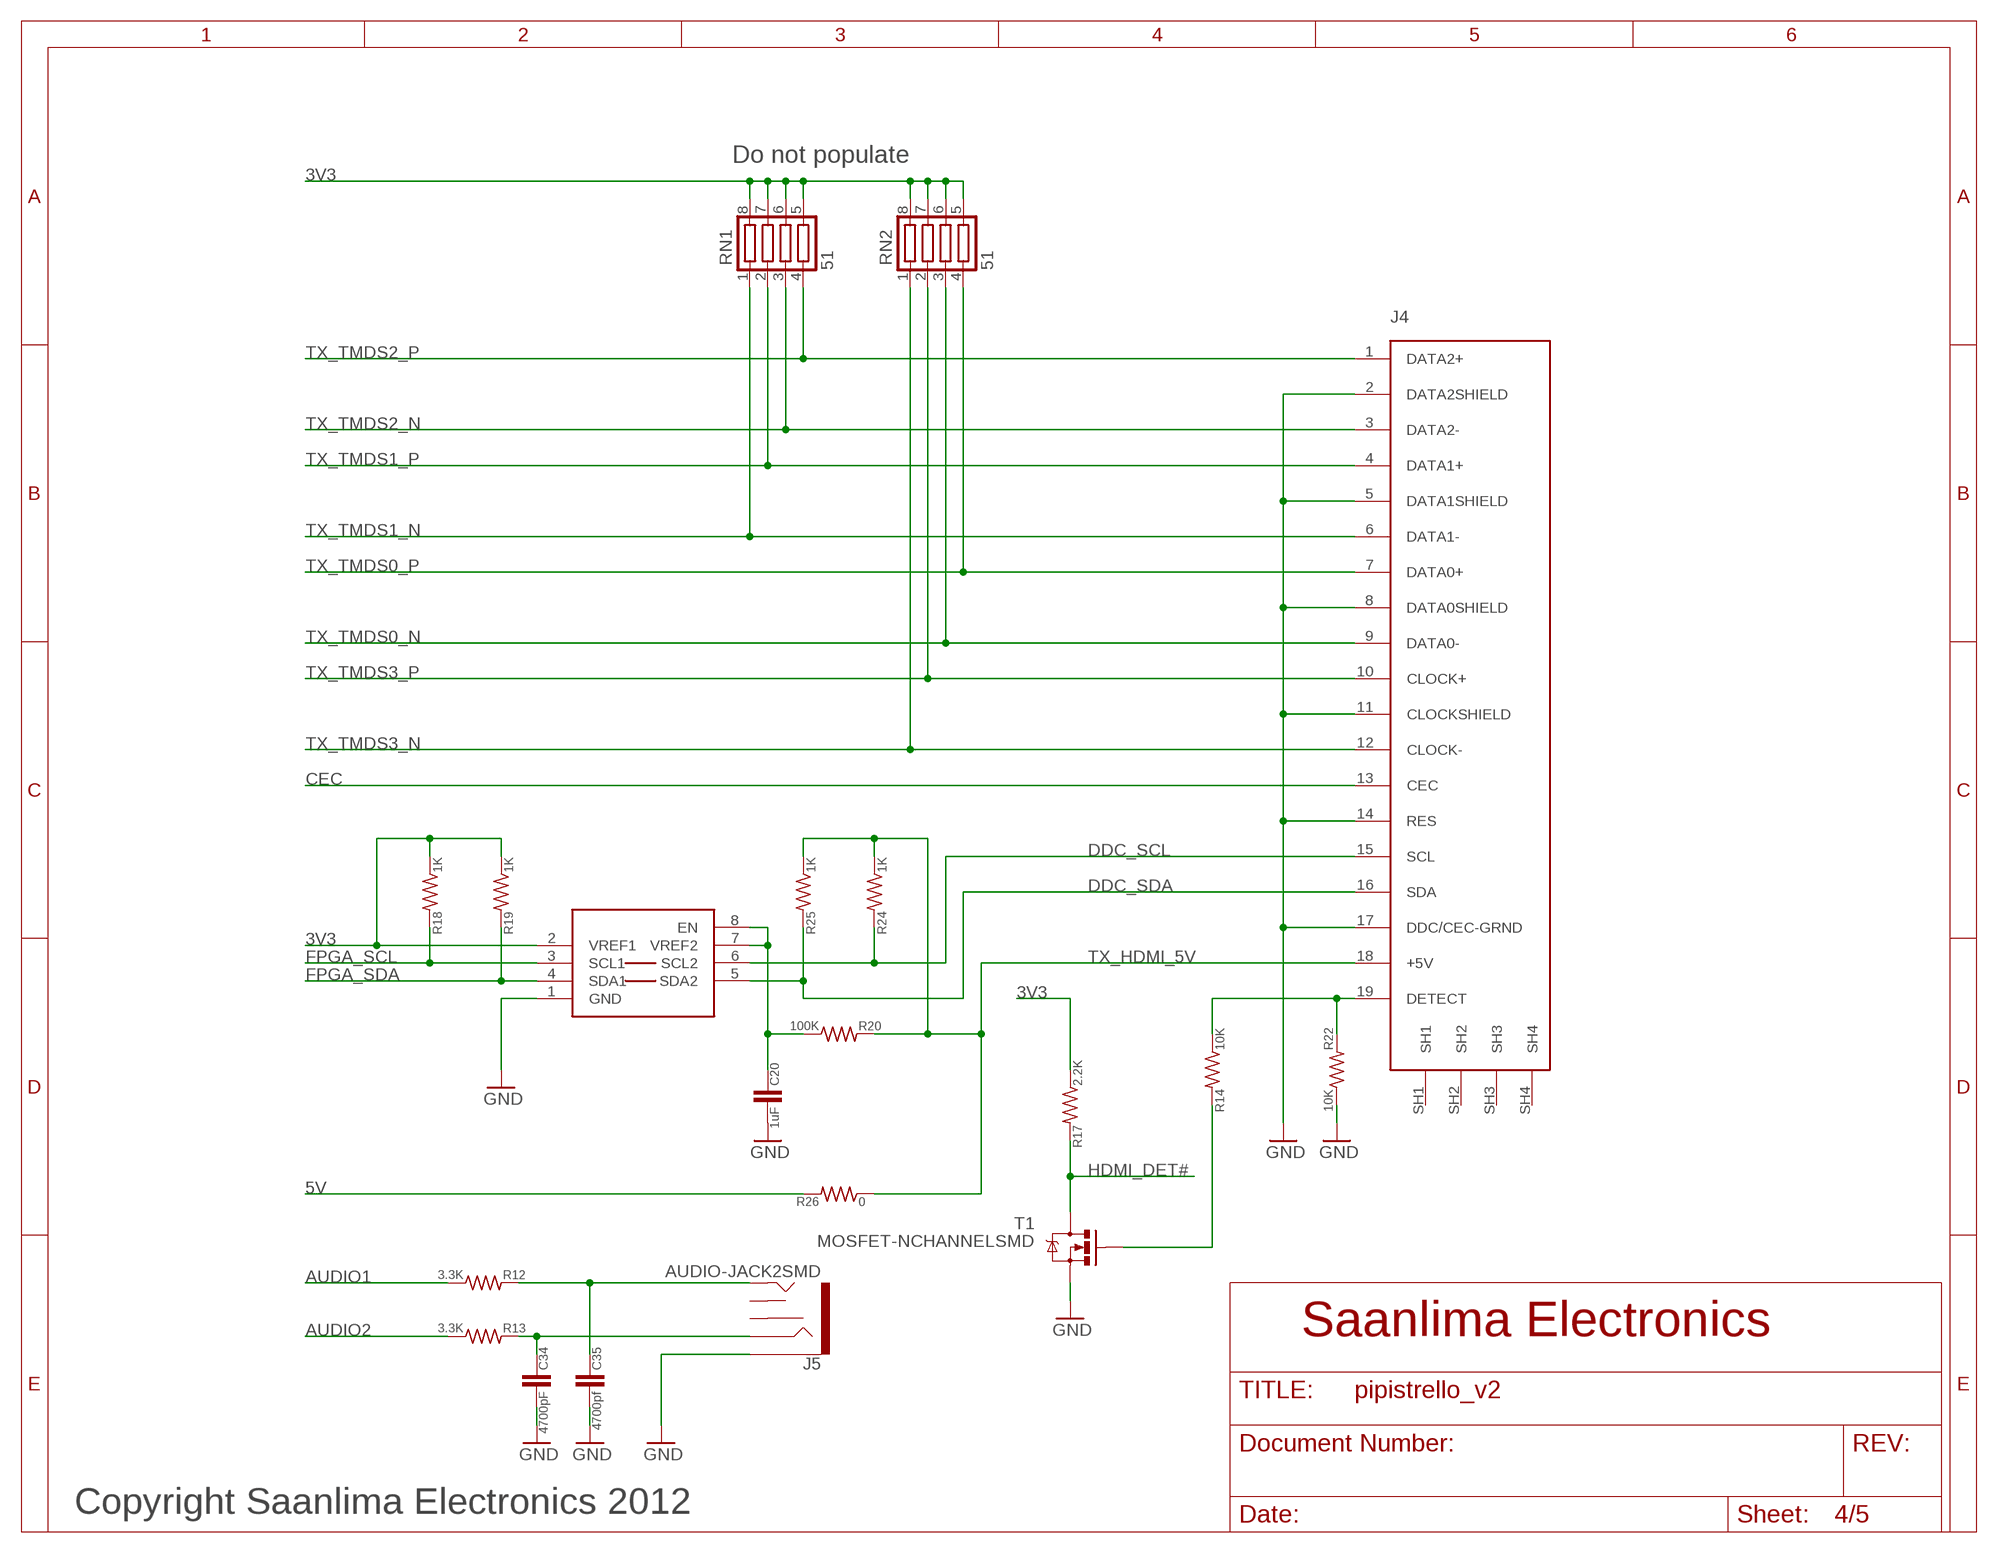
[diagram p3: schematic, sheet 4]

### Parts
C20  1uF  C0402  [0402]
C34  4700pF  C0402  [0402]
C35  4700pf  C0402  [0402]
J4  HDMI-TYPE-A-RECEPTICALFCI10029449  [FCI-HDMI-TYPE-A-RECEPT]
J5  AUDIO-JACK2SMD  [AUDIO-JACK-3.5MM-SMD]
R12  3.3K  R0402  [0402]
R13  3.3K  R0402  [0402]
R14  10K  R0402  [0402]
R17  2.2K  R0402  [0402]
R18  1K  R0402  [0402]
R19  1K  R0402  [0402]
R20  100K  R0402  [0402]
R22  10K  R0402  [0402]
R24  1K  R0402  [0402]
R25  1K  R0402  [0402]
R26  0  R0402  [0402]
RN1  51  CTS742C083  [CTS742C083]
RN2  51  CTS742C083  [CTS742C083]
T1  MOSFET-NCHANNELSMD  [SOT23-3]
U11  PCA9306  [PSOP-8]

### Nets
3V3: R17.1 R18.1 R19.1 RN1.5 RN1.6 RN1.7 RN1.8 RN2.5 RN2.6 RN2.7 RN2.8 U11.2(VREF1) ; also sheet 1,2,3,5
5V [power]: R26.2 ; also sheet 2,5
AUDIO1: R12.1 ; also sheet 3
AUDIO2: R13.1 ; also sheet 3
CEC: J4.13(CEC)
DDC_SCL: J4.15(SCL) R24.2 U11.6(SCL2)
DDC_SDA: J4.16(SDA) R25.2 U11.5(SDA2)
DETECT: J4.19(DETECT) R14.1 R22.2
FPGA_SCL: R18.2 U11.3(SCL1) ; also sheet 3
FPGA_SDA: R19.2 U11.4(SDA1) ; also sheet 3
GND: C20.2 C34.2 C35.2 J4.2(DATA2SHIELD) J4.5(DATA1SHIELD) J4.8(DATA0SHIELD) J4.11(CLOCKSHIELD) J4.14(RES) J4.17(DDC/CEC-GRND) J5.SLEEVE R22.1 T1.2(S) U11.1(GND) ; also sheet 1,2,3,5
HDMI_DET#: R17.2 T1.3(D) ; also sheet 3
N$2: C20.1 R20.1 U11.7(VREF2) U11.8(EN)
N$17: R14.2 T1.1(G)
N$22: C34.1 J5.RING R13.2
N$23: C35.1 J5.TIP R12.2
TX_HDMI_5V: J4.18(+5V) R20.2 R24.1 R25.1 R26.1
TX_TMDS0_N: J4.9(DATA0-) RN2.3 ; also sheet 3
TX_TMDS0_P: J4.7(DATA0+) RN2.4 ; also sheet 3
TX_TMDS1_N: J4.6(DATA1-) RN1.1 ; also sheet 3
TX_TMDS1_P: J4.4(DATA1+) RN1.2 ; also sheet 3
TX_TMDS2_N: J4.3(DATA2-) RN1.3 ; also sheet 3
TX_TMDS2_P: J4.1(DATA2+) RN1.4 ; also sheet 3
TX_TMDS3_N: J4.12(CLOCK-) RN2.1 ; also sheet 3
TX_TMDS3_P: J4.10(CLOCK+) RN2.2 ; also sheet 3
Unconnected: J4.SH1 J4.SH2 J4.SH3 J4.SH4 J5.RSH J5.TSH

### Notes on the sheet
- Do not populate
- Saanlima Electronics
- Copyright Saanlima Electronics 2012

## Sheet 5 of 5
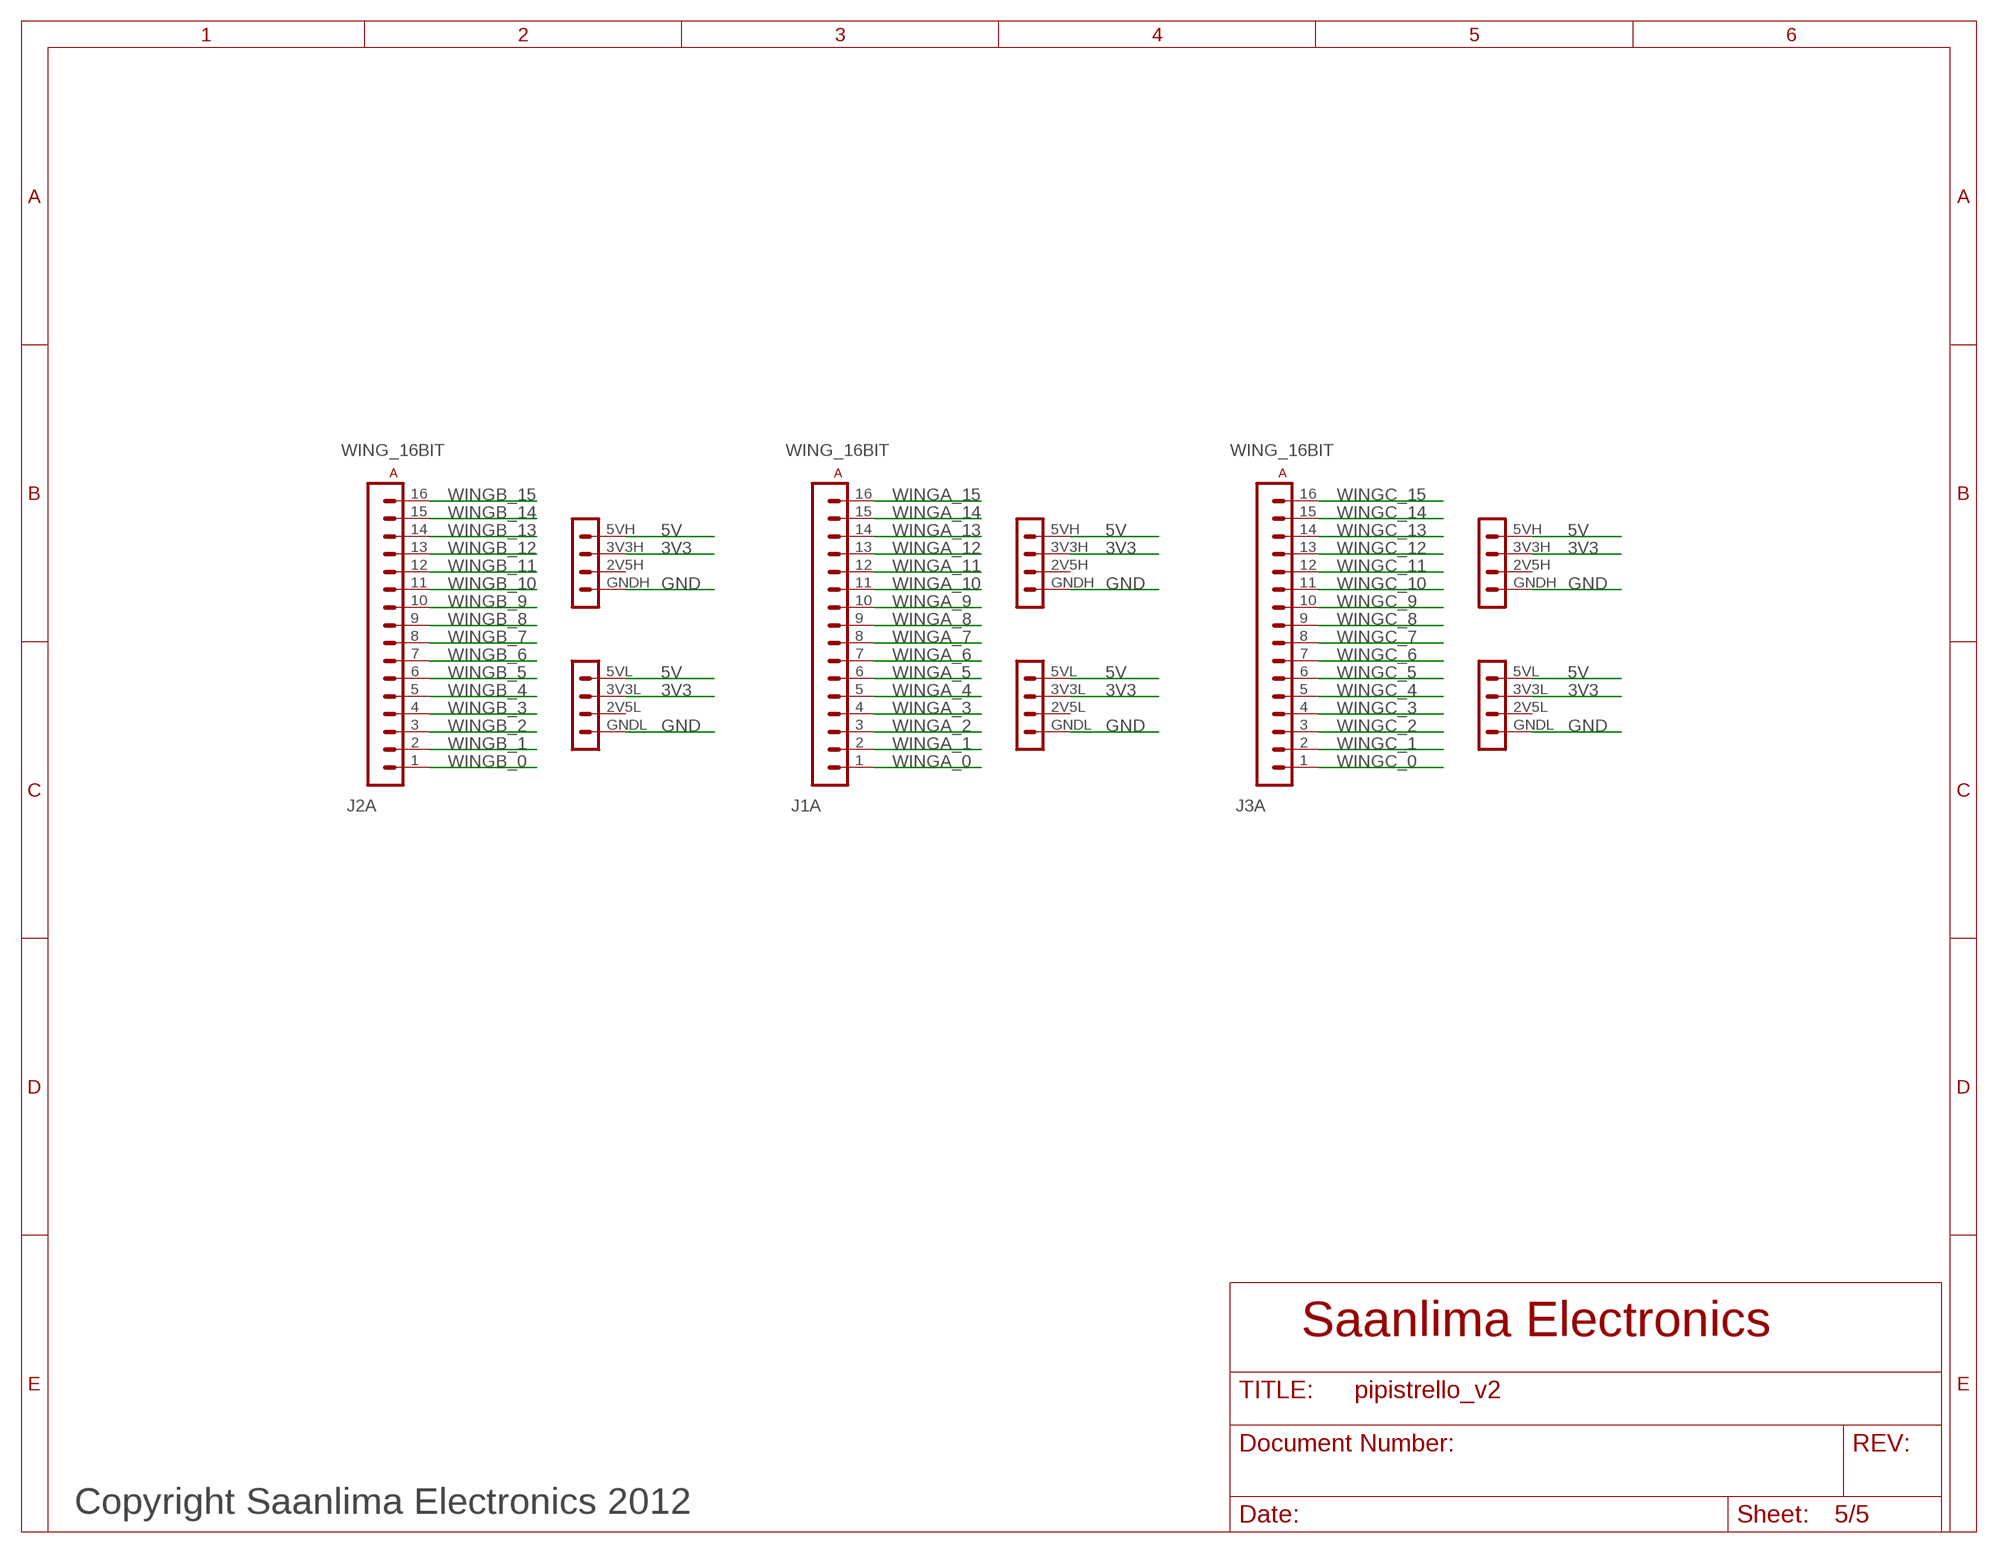
[diagram p4: schematic, sheet 5]

### Parts
J1  WING_16BIT  [WING_16BIT]
J2  WING_16BIT  [WING_16BIT]
J3  WING_16BIT  [WING_16BIT]

### Nets
3V3: J1.3V3H(PH:3V3) J1.3V3L(PL:3V3) J2.3V3H(PH:3V3) J2.3V3L(PL:3V3) J3.3V3H(PH:3V3) J3.3V3L(PL:3V3) ; also sheet 1,2,3,4
5V [power]: J1.5VH(PH:5V) J1.5VL(PL:5V) J2.5VH(PH:5V) J2.5VL(PL:5V) J3.5VH(PH:5V) J3.5VL(PL:5V) ; also sheet 2,4
GND: J1.GNDH(PH:GND) J1.GNDL(PL:GND) J2.GNDH(PH:GND) J2.GNDL(PL:GND) J3.GNDH(PH:GND) J3.GNDL(PL:GND) ; also sheet 1,2,3,4
WINGA_0: J1.1(A:A1) ; also sheet 3
WINGA_1: J1.2(A:A2) ; also sheet 3
WINGA_2: J1.3(A:A3) ; also sheet 3
WINGA_3: J1.4(A:A4) ; also sheet 3
WINGA_4: J1.5(A:A5) ; also sheet 3
WINGA_5: J1.6(A:A6) ; also sheet 3
WINGA_6: J1.7(A:A7) ; also sheet 3
WINGA_7: J1.8(A:A8) ; also sheet 3
WINGA_8: J1.9(A:A9) ; also sheet 3
WINGA_9: J1.10(A:A10) ; also sheet 3
WINGA_10: J1.11(A:A11) ; also sheet 3
WINGA_11: J1.12(A:A12) ; also sheet 3
WINGA_12: J1.13(A:A13) ; also sheet 3
WINGA_13: J1.14(A:A14) ; also sheet 3
WINGA_14: J1.15(A:A15) ; also sheet 3
WINGA_15: J1.16(A:A16) ; also sheet 3
WINGB_0: J2.1(A:A1) ; also sheet 3
WINGB_1: J2.2(A:A2) ; also sheet 3
WINGB_2: J2.3(A:A3) ; also sheet 3
WINGB_3: J2.4(A:A4) ; also sheet 3
WINGB_4: J2.5(A:A5) ; also sheet 3
WINGB_5: J2.6(A:A6) ; also sheet 3
WINGB_6: J2.7(A:A7) ; also sheet 3
WINGB_7: J2.8(A:A8) ; also sheet 3
WINGB_8: J2.9(A:A9) ; also sheet 3
WINGB_9: J2.10(A:A10) ; also sheet 3
WINGB_10: J2.11(A:A11) ; also sheet 3
WINGB_11: J2.12(A:A12) ; also sheet 3
WINGB_12: J2.13(A:A13) ; also sheet 3
WINGB_13: J2.14(A:A14) ; also sheet 3
WINGB_14: J2.15(A:A15) ; also sheet 3
WINGB_15: J2.16(A:A16) ; also sheet 3
WINGC_0: J3.1(A:A1) ; also sheet 3
WINGC_1: J3.2(A:A2) ; also sheet 3
WINGC_2: J3.3(A:A3) ; also sheet 3
WINGC_3: J3.4(A:A4) ; also sheet 3
WINGC_4: J3.5(A:A5) ; also sheet 3
WINGC_5: J3.6(A:A6) ; also sheet 3
WINGC_6: J3.7(A:A7) ; also sheet 3
WINGC_7: J3.8(A:A8) ; also sheet 3
WINGC_8: J3.9(A:A9) ; also sheet 3
WINGC_9: J3.10(A:A10) ; also sheet 3
WINGC_10: J3.11(A:A11) ; also sheet 3
WINGC_11: J3.12(A:A12) ; also sheet 3
WINGC_12: J3.13(A:A13) ; also sheet 3
WINGC_13: J3.14(A:A14) ; also sheet 3
WINGC_14: J3.15(A:A15) ; also sheet 3
WINGC_15: J3.16(A:A16) ; also sheet 3
Unconnected: J1.2V5H(PH:2V5) J1.2V5L(PL:2V5) J2.2V5H(PH:2V5) J2.2V5L(PL:2V5) J3.2V5H(PH:2V5) J3.2V5L(PL:2V5)

### Notes on the sheet
- Saanlima Electronics
- Copyright Saanlima Electronics 2012

## Library data of the parts
C1-C40 C42 = saanlima:C
J1-J3 = saanlima:WING_16BIT
J4 = saanlima:HDMI-TYPE-A-RECEPTICAL
J5 = saanlima:AUDIO-JACK2
J6 = saanlima:MA06-1: PIN HEADER
J7 = saanlima:USB-MINIB: Mini-USB "B" connector with 5th pin broken out.
J8 = saanlima:USD-SOCKET: microSD Socket
J9 = saanlima:PMOD
JP1-JP8 = saanlima:FIDUCIAL: Fiducial Alignment Points Various fiducial points for machine vision alignment.
L1-L3 = saanlima:FERRITE: Ferrite Bead
LED1-LED7 = saanlima:LED: LED
Q1 = saanlima:CRYSTAL: Crystals Various standard crystals.
R1-R34 = saanlima:R
RN1-RN3 = saanlima:CTS742C083: Chip Resistor Array 4 Single Resistor Source: http://www.ctscorp.com/components/Datasheets/CTSChipArrayDs.pdf; OC_FARNELL: unknown; OC_NEWARK: unknown
S1 = saanlima:SWITCH-MOMENTARY-2
T1 = saanlima:MOSFET-NCHANNEL
U1 U5 = saanlima:OSCILLATOR
U2 = saanlima:FLASH-SPI-25XX: SPI Flash
U3 U6 U10 = saanlima:V_REG_LM1117: Voltage Regulator LM1117
U4 = xilinx_devices:6SLX9CSG324: Xilinx FPGA: 6SLX9CSG324
U7 = saanlima:FT2232H: DUAL HIGH SPEED USB TO MULTIPURPOSE UART/FIFO IC
U8 = saanlima:DIGITAL-EEPROM-MICROWIRE-6P
U9 = sdram:MT46H32M16LF
U11 = saanlima:PCA9306

## Net classes
1 power: width 0.203 mm